# Altium project PCB_Project_test.PrjPcb
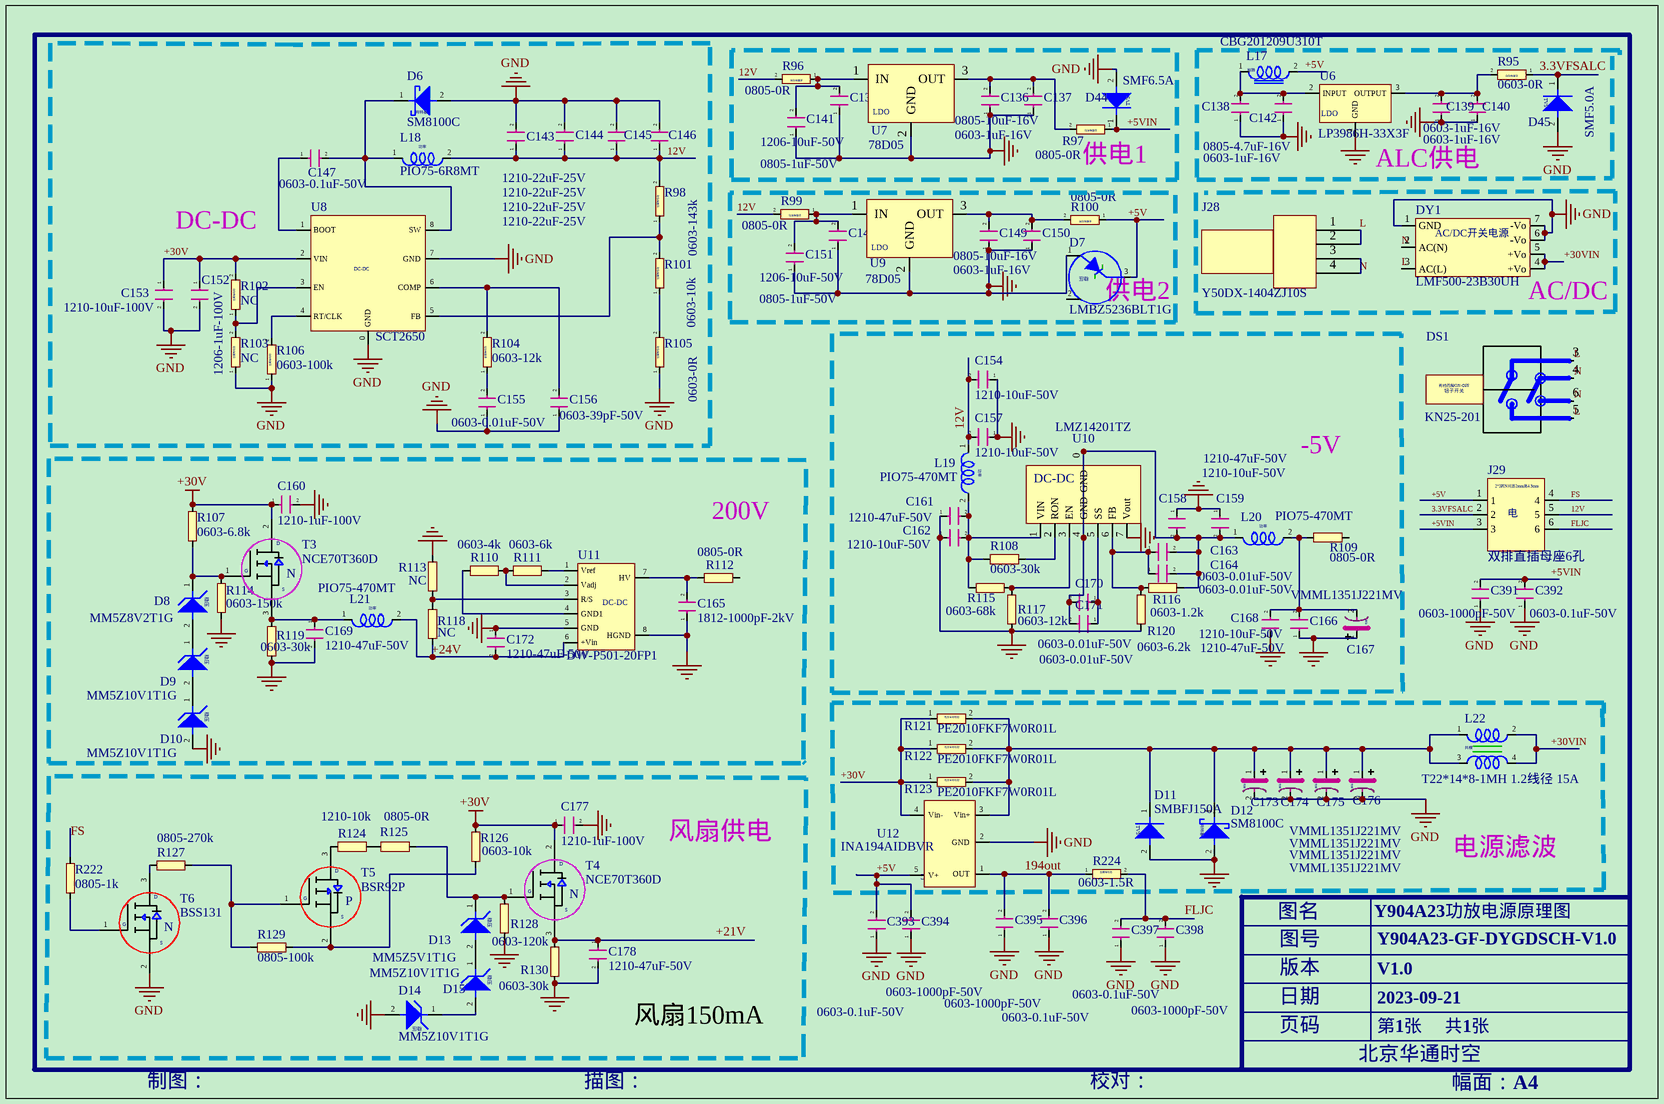
[diagram p0: Y904A23-GF-DYGDSCH-V1.0.SchDoc]
1 sheet, 123 parts. Net scope: global (net labels, ports and power ports of the same name join across sheets).
Board files: Y904A23-GF-DYPCB-V1.0.PcbDoc, Y904A23-GF-DYGDSCH-V1.0.PcbDoc

## Sheet Y904A23-GF-DYGDSCH-V1.0.SchDoc: Y904A23功放电源原理图
size 292 x 193 mm; Date: 2023-09-21; Address1: Y904A23-GF-DYGDSCH-V1.0; Address2: 第1张     共1张; Revision: V1.0; SheetNumber: 1; SheetTotal: 1

### Parts
C135  0805-1uF-50V  [C0805]
C136  0805-10uF-16V  [C0805]
C137  0603-1uF-16V  [C0603]
C138  0805-4.7uF-16V  [C0805]
C139  0603-1uF-16V  [C0603]
C140  0603-1uF-16V  [C0603]
C141  1206-10uF-50V  [C1206]
C142  0603-1uF-16V  [C0603]
C143  1210-22uF-25V  [C1210]
C144  1210-22uF-25V  [C1210]
C145  1210-22uF-25V  [C1210]
C146  1210-22uF-25V  [C1210]
C147  0603-0.1uF-50V  [C0603]
C148  0805-1uF-50V  [C0805]
C149  0805-10uF-16V  [C0805]
C150  0603-1uF-16V  [C0603]
C151  1206-10uF-50V  [C1206]
C152  1206-1uF-100V  [C1206]
C153  1210-10uF-100V  [C1210]
C154  1210-10uF-50V  [C1210]
C155  0603-0.01uF-50V  [C0603]
C156  0603-39pF-50V  [C0603]
C157  1210-10uF-50V  [C1210]
C158  1210-10uF-50V  [C1210]
C159  1210-47uF-50V  [C1210]
C160  1210-1uF-100V  [C1210]
C161  1210-47uF-50V  [C1210]
C162  1210-10uF-50V  [C1210]
C163  0603-0.01uF-50V  [C0603]
C164  0603-0.01uF-50V  [C0603]
C165  1812-1000pF-2kV  [C1812]
C166  1210-47uF-50V  [C1210]
C167  VMML1351J221MV  [CAE-13.5X13.5X13.5mm(SMD)]
C168  1210-10uF-50V  [C1210]
C169  1210-47uF-50V  [C1210]
C170  0603-0.01uF-50V  [C0603]
C171  0603-0.01uF-50V  [C0603]
C172  1210-47uF-50V  [C1210]
C173  VMML1351J221MV  [CAE-13.5X13.5X13.5mm(SMD)]
C174  VMML1351J221MV  [CAE-13.5X13.5X13.5mm(SMD)]
C175  VMML1351J221MV  [CAE-13.5X13.5X13.5mm(SMD)]
C176  VMML1351J221MV  [CAE-13.5X13.5X13.5mm(SMD)]
C177  1210-1uF-100V  [C1210]
C178  1210-47uF-50V  [C1210]
C391  0603-1000pF-50V  [C0603]
C392  0603-0.1uF-50V  [C0603]
C393  0603-0.1uF-50V  [C0603]
C394  0603-1000pF-50V  [C0603]
C395  0603-1000pF-50V  [C0603]
C396  0603-0.1uF-50V  [C0603]
C397  0603-0.1uF-50V  [C0603]
C398  0603-1000pF-50V  [C0603]
D6  SM8100C  [SMC]
D7  LMBZ5236BLT1G  [SOT-23]
D8  MM5Z8V2T1G  [SOD-523]
D9  MM5Z10V1T1G  [SOD-523]
D10  MM5Z10V1T1G  [SOD-523]
D11  SMBFJ150A  [SMB]
D12  SM8100C  [SMC]
D13  MM5Z5V1T1G  [SOD-523]
D14  MM5Z10V1T1G  [SOD-523]
D15  MM5Z10V1T1G  [SOD-523]
D44  SMF6.5A  [SOD-123FL]
D45  SMF5.0A  [SOD-123FL]
DS1  KN25-201  [KN25-201]
DY1  LMF500-23B30UH  [LMF500-23B30UH]  (value not drawn)
J28  Y50DX-1404ZJ10S  [Y50DX-1404ZJ10S]
J29  双排直插母座6孔  [双排直插母座6孔（2*3PIN间距2高4.3）]
L17  CBG201209U310T  [L0805]
L18  PIO75-6R8MT  [L7.8x7.0x5.0]
L19  PIO75-470MT  [L7.8x7.0x5.0]
L20  PIO75-470MT  [L7.8x7.0x5.0]
L21  PIO75-470MT  [L7.8x7.0x5.0]
L22  T22*14*8-1MH 1.2线径 15A  [T22*14*8]
R95  0603-0R  [R0603]
R96  0805-0R  [R0805]
R97  0805-0R  [R0805]
R98  0603-143k  [R0603]
R99  0805-0R  [R0805]
R100  0805-0R  [R0805]
R101  0603-10k  [R0603]
R102  NC  [R0603]
R103  NC  [R0603]
R104  0603-12k  [R0603]
R105  0603-0R  [R0603]
R106  0603-100k  [R0603]
R107  0603-6.8k  [R0603]
R108  0603-30k  [R0603]
R109  0805-0R  [R0805]
R110  0603-4k  [R0603]
R111  0603-6k  [R0603]
R112  0805-0R  [R0805]
R113  NC  [R0603]
R114  0603-150k  [R0603]
R115  0603-68k  [R0603]
R116  0603-1.2k  [R0603]
R117  0603-12k  [R0603]
R118  NC  [R0603]
R119  0603-30k  [R0603]
R120  0603-6.2k  [R0603]
R121  PE2010FKF7W0R01L  [R2010]
R122  PE2010FKF7W0R01L  [R2010]
R123  PE2010FKF7W0R01L  [R2010]
R124  1210-10k  [R1210]
R125  0805-0R  [R0805]
R126  0603-10k  [R0603]
R127  0805-270k  [R0805]
R128  0603-120k  [R0603]
R129  0805-100k  [R0805]
R130  0603-30k  [R0603]
R222  0805-1k  [R0805]
R224  0603-1.5R  [R0603]
T3  NCE70T360D  [TO-263-2]
T4  NCE70T360D  [TO-263-2]
T5  BSR92P  [SOT-23]
T6  BSS131  [SOT-23]
U6  LP3986H-33X3F  [SOT-89]
U7  78D05  [TO-252]
U8  SCT2650  [ESOP8L]
U9  78D05  [TO-252]
U10  LMZ14201TZ  [TO-263-7]
U11  DW-P501-20FP1  [DW-PXXX-20XP1]
U12  INA194AIDBVR  [SOT-23-5]

### Blocks framed on the sheet
DC-DC: C143-C147 C152 C153 C155 C156 D6 L18 R98 R101-R106 U8
-5V: C154 C157-C159 C161-C164 C166-C168 C170 C171 L19 L20 R108 R109 R115-R117 R120 U10

### Nets
+30V: C152.1 C153.1 C160.1 C177.1 R102.2 R107.1 R121.1 R122.1 R123.1 R126.1 T3.2(D) T4.2(D) U8.2(VIN) U12.4(Vin-)
GND: C135.1 C136.1 C137.1 C138.1 C139.1 C140.1 C141.1 C142.1 C143.2 C144.2 C145.2 C146.2 C148.1 C149.1 C150.1 C151.1 C152.2 C153.2 C154.1 C155.1 C156.1 C157.1 C158.1 C159.1 C160.2 C161.1 C162.1 C165.1 C166.1 C167.1 C168.1 C169.2 C172.1 C173.2 C174.2 C175.2 C176.2 C177.2 C178.2 C391.1 C392.1 C393.1 C394.1 C395.1 C396.1 C397.1 C398.1 D6.2 D7.1 D10.2 D11.2 D12.2 D14.2 D44.2 D45.2 DY1.1(GND) DY1.6(-Vo) DY1.7(-Vo) R103.1 R105.1 R106.1 R113.1 R114.2 R117.1 R119.2 R120.1 R128.2 R130.2 T6.2(S) U6.1(GND) U7.2(GND) U8.0(GND) U8.7(GND) U9.2(GND) U10.7(Vout) U11.5(GND) U11.8(HGND) U12.2(GND)
3.3VFSALC: D45.1 J29.2 R95.1
12V: C143.1 C144.1 C145.1 C146.1 C154.2 C157.2 J29.5 L18.2 L19.1 R96.2 R98.2 R99.2
194out: C395.2 C396.2 R224.1 U12.1(OUT)
+5V: C393.2 C394.2 D7.3 J29.1 L17.2 R100.1 U12.5(V+)
+5VIN: C391.2 C392.2 D44.1 J29.3 R97.1
+21V: C178.1 R130.1 T4.3(S)
+30VIN: DY1.4(+Vo) DY1.5(+Vo) L22.2 L22.4
FLJC: C397.2 C398.2 J29.6 R224.2
FS: J29.4 R222.2
L: DS1.3 DS1.5 DY1.3(AC(L)) J28.1 J28.2
N: DS1.4 DS1.6 DY1.2(AC(N)) J28.3 J28.4
NetC135_2: C135.2 C141.2 R96.1 U7.1(IN)
NetC136_2: C136.2 C137.2 R97.2 U7.3(OUT)
NetC138_2: C138.2 C142.2 L17.1 U6.2(INPUT)
NetC139_2: C139.2 C140.2 R95.2 U6.3(OUTPUT)
NetC147_1: C147.1 U8.1(BOOT)
NetC147_2: C147.2 D6.1 L18.1 U8.8(SW)
NetC148_2: C148.2 C151.2 R99.1 U9.1(IN)
NetC149_2: C149.2 C150.2 R100.2 U9.3(OUT)
NetC155_2: C155.2 R104.1
NetC156_2: C156.2 R104.2 U8.6(COMP)
NetC158_2: C158.2 C159.2 C163.2 C164.2 C170.2 C171.2 L20.1 R116.1 U10.0(GND) U10.4(GND)
NetC161_2: C161.2 C162.2 L19.2 R108.2 R115.1 U10.1(VIN)
NetC163_1: C163.1 C164.1 R116.2 R120.2 U10.6(FB)
NetC165_2: C165.2 R112.2 U11.7(HV)
NetC166_2: C166.2 C167.2 C168.2 L20.2 R109.2
NetC169_1: C169.1 L21.1 R119.1 T3.3(S)
NetC170_1: C170.1 C171.1 U10.5(SS)
NetC172_2: C172.2 L21.2 R118.1 U11.6(+Vin)
NetC173_1: C173.1 C174.1 C175.1 C176.1 D11.1 D12.1 L22.1 L22.3 R121.2 R122.2 R123.2 U12.3(Vin+)
NetD8_1: D8.1 R107.2 R114.1 T3.1(G)
NetD8_2: D8.2 D9.1
NetD9_2: D9.2 D10.1
NetD13_1: D13.1 R125.1 R128.1 T4.1(G)
NetD13_2: D13.2 D15.1
NetD14_1: D14.1 D15.2
NetR98_1: R98.1 R101.2 U8.5(FB)
NetR101_1: R101.1 R105.2
NetR102_1: R102.1 R103.2 U8.3(EN)
NetR106_2: R106.2 U8.4(RT/CLK)
NetR108_1: R108.1 U10.2(RON)
NetR110_1: R110.1 U11.4(GND1)
NetR110_2: R110.2 R111.1 U11.2(Vadj)
NetR111_2: R111.2 U11.1(Vref)
NetR113_2: R113.2 R118.2 U11.3(R/S)
NetR115_2: R115.2 R117.2 U10.3(EN)
NetR124_1: R124.1 T5.3(D)
NetR124_2: R124.2 R125.2
NetR126_2: R126.2 R129.2 T5.2(S)
NetR127_1: R127.1 T6.3(D)
NetR127_2: R127.2 R129.1 T5.1(G)
NetR222_1: R222.1 T6.1(G)

Not connected (* = marked no-connect by the designer): D7 2; R109 1; R112 1

### Notes on the sheet
- (near R97) 供电1
- ALC供电
- (near D7) 供电2
- (near DY1) AC/DC
- 200V
- 风扇供电
- 电源滤波
- 风扇150mA
- Labels drawn without touching a wire or pin: +24V
- 图名
- 版本
- 图号
- 页码
- 日期
- 制图：
- 描图：
- 校对：
- 北京华通时空
- 幅面：A4
- (in symbol 78D05) LDO
- (in symbol BSR92P) P
- (in symbol BSS131) N
- (in symbol CBG201209U310T) 磁珠
- (in symbol DW-P501-20FP1) DC-DC
- (in symbol INA194AIDBVR) DC-DC
- (in symbol KN25-201) 两档四脚ON-OFF; 钮子开关
- (in symbol LMBZ5236BLT1G) 稳压
- (in symbol LMF500-23B30UH) AC/DC开关电源
- (in symbol LMZ14201TZ) DC-DC
- (in symbol LP3986H-33X3F) LDO
- (in symbol MM5Z5V1T1G) 稳压
- (in symbol MM5Z8V2T1G) 稳压
- (in symbol MM5Z10V1T1G) 稳压
- (in symbol NCE70T360D) N
- (in symbol PE2010FKF7W0R01L) 电流采样电阻
- (in symbol PIO75-6R8MT) 功率
- (in symbol PIO75-470MT) 功率
- (in symbol Resistance) 金属釉电阻
- (in symbol SCT2650) DC-DC
- (in symbol SM8100C) 肖特基
- (in symbol SMBFJ150A) TVS
- (in symbol SMF5.0A) TVS
- (in symbol SMF6.5A) TVS
- (in symbol T22*14*8-1MH 1.2线径 15A) 共模
- (in symbol VMML1351J221MV) 电解
- (in symbol 双排直插母座6孔) 电

### Library data of the parts
C135-C166 C168-C172 C177 C178 C391-C398 = Cap1: 陶瓷电容,厂家; 性能: 陶瓷电容; 厂家: *; 封装描述: *
C167 C173-C176 = VMML1351J221MV: 电解电容,Ymin永铭; 性能: 63V220UF; 封装描述: 13.5X13.5X13.5mm; 厂家: Ymin永铭
D6 D12 = SM8100C: 肖特基二极管,乐山无线电; 性能: 100V，8A; 厂家: 乐山无线电; 封装描述: SMC
D7 = LMBZ5236BLT1G: 稳压二极管,乐山无线电; 性能: 7.12~7.88V; 厂家: 乐山无线电; 封装描述: SOT-23
D8 = MM5Z8V2T1G: 稳压二极管,ON安森美; 性能: 8.2V; 厂家: ON安森美; 封装描述: SOD-523
D9 D10 D14 D15 = MM5Z10V1T1G: 稳压二极管,ON安森美; 厂家: ON安森美; 性能: *; 封装描述: SOD-523
D11 = SMBFJ150A: TVS二极管,乐山无线电; 性能: 150V，2.5A; 厂家: 乐山无线电; 封装描述: SMB
D13 = MM5Z5V1T1G: 稳压二极管,ON安森美; 性能: 5.1V; 厂家: ON安森美; 封装描述: SOD-523
D44 = SMF6.5A: TVS二极管,江苏长电/长晶; 性能: 6.5V，17.8A; 厂家: 江苏长电/长晶; 封装描述: SOD-123FL
D45 = SMF5.0A: TVS二极管,江苏长电/长晶; 性能: 5V，21.7A; 厂家: 江苏长电/长晶; 封装描述: SOD-123FL
DS1 = KN25-201: 钮子开关,上海星宇; 封装描述: 33.5X29×19.5; 性能: 25A; 厂家: 上海星宇
DY1 = LMF500-23B30UH: AC/DC 500W 机壳开关电源，广州金升阳
J28 = Y50DX-1404ZJ10S: 航空插头座母,泰兴领航; 性能: 4芯PIN大电流40A; 厂家: 泰兴领航
J29 = 双排直插母座6孔: 电连接器,厂家; 封装描述: 2*3PIN间距2mm高4.3mm; 厂家: *; 性能: 双排直插母座6孔
L17 = CBG201209U310T: 磁珠,风华; 性能: 31Ω@100MHz,900mA; 厂家: 风华; 封装描述: L0805
L18 = PIO75-6R8MT: 功率电感,风华; 性能: 6.8uH，3.0A，41mΩ; 封装描述: L7.8x7.0x5.0mm; 厂家: 风华
L19-L21 = PIO75-470MT: 功率电感,风华; 性能: 47uH，1.25A，190mΩ; 封装描述: L7.8x7.0x5.0mm; 厂家: 风华
L22 = T22*14*8-1MH 1.2线径 15A: 共模电感,深圳凯必达; 封装描述: T14*8*7; 性能: 成品外径16.5mm,成品厚度10.5mm,1mH0.8线径8A; 厂家: 深圳凯必达
R95-R106 R224 = Resistance: 金属釉电阻,厂家; 性能: *; 厂家: *; 封装描述: *
R107-R120 R124-R130 R222 = Resistance: 金属釉电阻,厂家; Value: 137R
R121-R123 = PE2010FKF7W0R01L: 电流采样电阻,YAGEO(国巨); 性能: 10mΩ ±1% 1W; 封装描述: 2010; 厂家: YAGEO(国巨)
T3 T4 = NCE70T360D: NMOS,无锡新洁能; 性能: VDS =700V,ID=7A,Vth=3~4V; 封装描述: TO-263; 厂家: 无锡新洁能
T5 = BSR92P: PMOS,Infineon英飞凌; 性能: VDS =-250V,ID=-0.11A,Vth=-2~-1V; 厂家: Infineon英飞凌; 封装: SOT-23
T6 = BSS131: NMOS,Infineon英飞凌; 性能: VDS =240V,ID=0.09A,Vth=0.8~1.8V; 厂家: Infineon英飞凌; 封装: SOT-23
U6 = LP3986H-33X3F: LDO,微源半导体; 性能: 2.5 ~ 6.5V,3.3V,500mA; 厂家: 微源半导体; 封装描述: SOT-89
U7 U9 = 78D05: LDO,佛山蓝箭; 性能: 7~36V,5V,1.5A; 厂家: 佛山蓝箭; 封装描述: TO-252
U8 = SCT2650: DC-DC,芯洲科技; 性能: 4.5~60V,0.8~57V,5A; 厂家: 芯洲科技; 封装描述: ESOP8L
U10 = LMZ14201TZ: DC-DC,TI德州仪器; 性能: 6~42V,0.8~6V,1A; 封装描述: TO-263-7; 厂家: TI德州仪器
U11 = DW-P501-20FP1: DC-DC,东文; 性能: 24V/500V/20mA; 封装描述: 50*35*20mm; 厂家: 东文
U12 = INA194AIDBVR: 分流监测计,TI; 厂家: 圣邦微; 封装: SOT23-5; 性能: -5V 60mA